# EAGLE schematic Analog Breakout - Schematic (EAGLE 6.5.0)
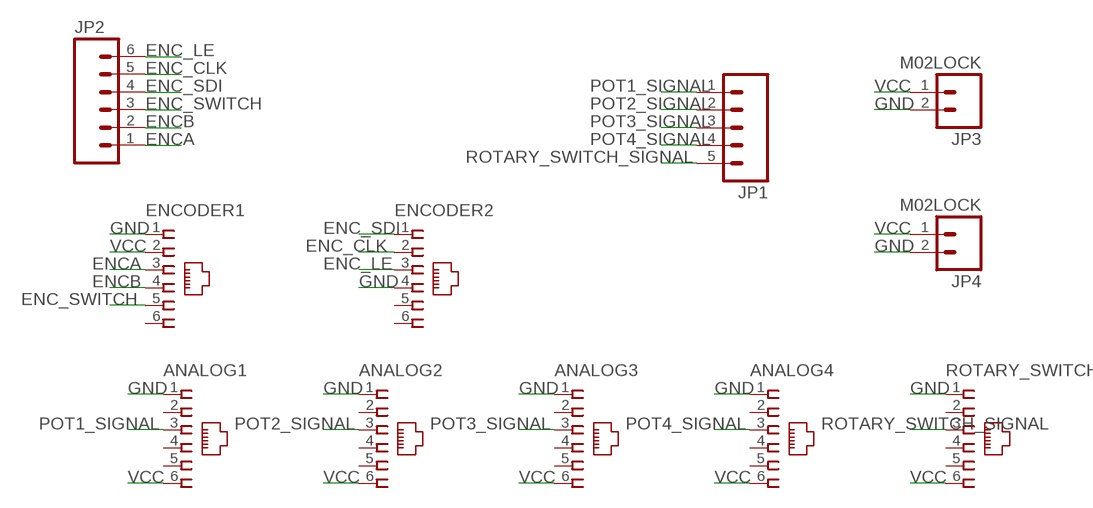
[diagram p0: schematic, sheet 1]

## Parts
ANALOG1  555165-1  [555165-1]
ANALOG2  555165-1  [555165-1]
ANALOG3  555165-1  [555165-1]
ANALOG4  555165-1  [555165-1]
ENCODER1  555165-1  [555165-1]
ENCODER2  555165-1  [555165-1]
JP1  M05LOCK  [1X05_LOCK]
JP2  M06LOCK  [1X06_LOCK]
JP3  M02LOCK  [1X02_LOCK]
JP4  M02LOCK  [1X02_LOCK]
ROTARY_SWITCH  555165-1  [555165-1]

## Nets
ENC_CLK: ENCODER2.2 JP2.5
ENC_LE: ENCODER2.3 JP2.6
ENC_SDI: ENCODER2.1 JP2.4
ENC_SWITCH: ENCODER1.5 JP2.3
ENCA: ENCODER1.3 JP2.1
ENCB: ENCODER1.4 JP2.2
GND: ANALOG1.1 ANALOG2.1 ANALOG3.1 ANALOG4.1 ENCODER1.1 ENCODER2.4 JP3.2 JP4.2 ROTARY_SWITCH.1
POT1_SIGNAL: ANALOG1.3 JP1.1
POT2_SIGNAL: ANALOG2.3 JP1.2
POT3_SIGNAL: ANALOG3.3 JP1.3
POT4_SIGNAL: ANALOG4.3 JP1.4
ROTARY_SWITCH_SIGNAL: JP1.5 ROTARY_SWITCH.3
VCC: ANALOG1.6 ANALOG2.6 ANALOG3.6 ANALOG4.6 ENCODER1.2 JP3.1 JP4.1 ROTARY_SWITCH.6
Unconnected: ANALOG1.2 ANALOG1.4 ANALOG1.5 ANALOG2.2 ANALOG2.4 ANALOG2.5 ANALOG3.2 ANALOG3.4 ANALOG3.5 ANALOG4.2 ANALOG4.4 ANALOG4.5 ENCODER1.6 ENCODER2.5 ENCODER2.6 ROTARY_SWITCH.2 ROTARY_SWITCH.4 ROTARY_SWITCH.5

## Library data of the parts
ANALOG1-ANALOG4 ENCODER1 ENCODER2 ROTARY_SWITCH = con-amp:555165-1: AMP connector
JP1 = SparkFun-Connectors:M05: Header 5 Standard 5-pin 0.1" header. Use with straight break away headers (SKU : PRT-00116), right angle break away headers (PRT-00553), swiss pins (PRT-00743), machine pins (PRT-00117), and female headers (PRT-00115). Molex polarized connector foot print use with SKU : PRT-08230 with associated crimp pins and housings.
JP2 = SparkFun-Connectors:M06: Header 6 Standard 6-pin 0.1" header. Use with straight break away headers (SKU : PRT-00116), right angle break away headers (PRT-00553), swiss pins (PRT-00743), machine pins (PRT-00117), and female headers (PRT-00115). Molex polarized connector foot print use with SKU : PRT-08094 with associated crimp pins and housings. NOTES ON THE VARIANTS LOCK and LOCK_LONGPADS... This footprint was designed to help hold the alignment of a through-hole component (i.e. 6-pin header) while soldering it into place. You may notice that each hole has been shifted either up or down by 0.005 of an inch from it's more standard position (which is a perfectly straight line). This slight alteration caused the pins (the squares in the middle) to touch the edges of the holes. Because they are alternating, it causes a "brace" to hold the component in place. 0.005 has proven to be the perfect amount of "off-center" position when using our standard breakaway headers. Although looks a little odd when you look at the bare footprint, once you have a header in there, the alteration is very hard to notice. Also,if you push a header all the way into place, it is covered up entirely on the bottom side. This idea of altering the position of holes to aid alignment will be further integrated into the Sparkfun Library for other footprints. It can help hold any component with 3 or more connection pins.
JP3 JP4 = SparkFun-Connectors:M02: Standard 2-pin 0.1" header. Use with - straight break away headers ( PRT-00116) - right angle break away headers (PRT-00553) - swiss pins (PRT-00743) - machine pins (PRT-00117) - female headers (PRT-00115) Molex polarized connector foot print use with: PRT-08233 with associated crimp pins and housings. 2.54_SCREWTERM for use with PRT-10571. 3.5mm Screw Terminal footprints for PRT-08084 5mm Screw Terminal footprints for use with PRT-08433